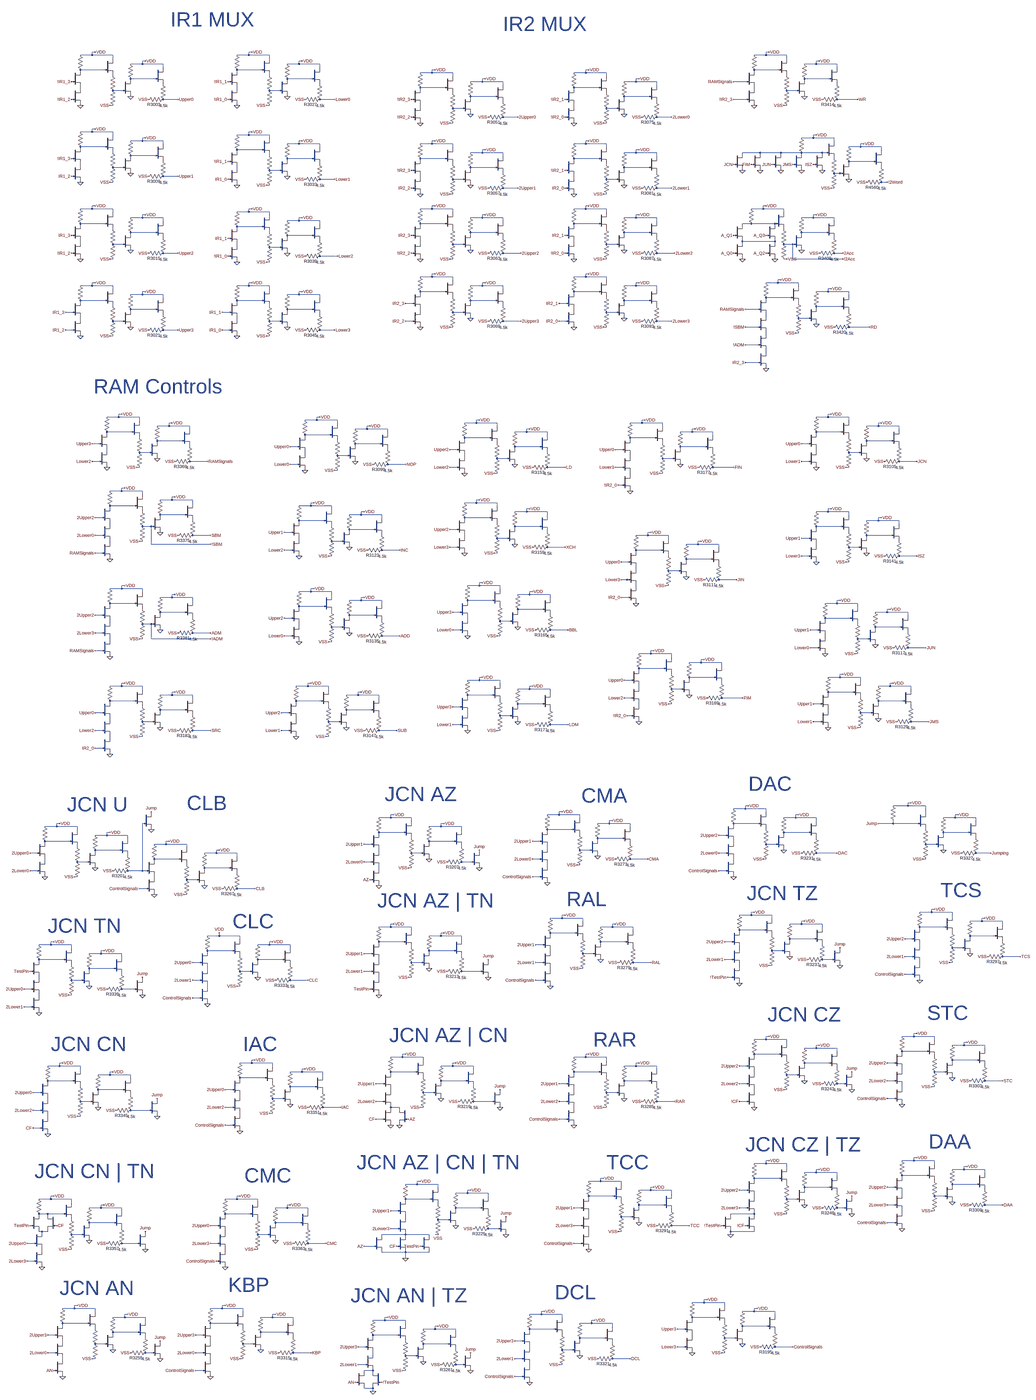
[diagram p0: schematic instruction_register_mux.asc, whole sheet]
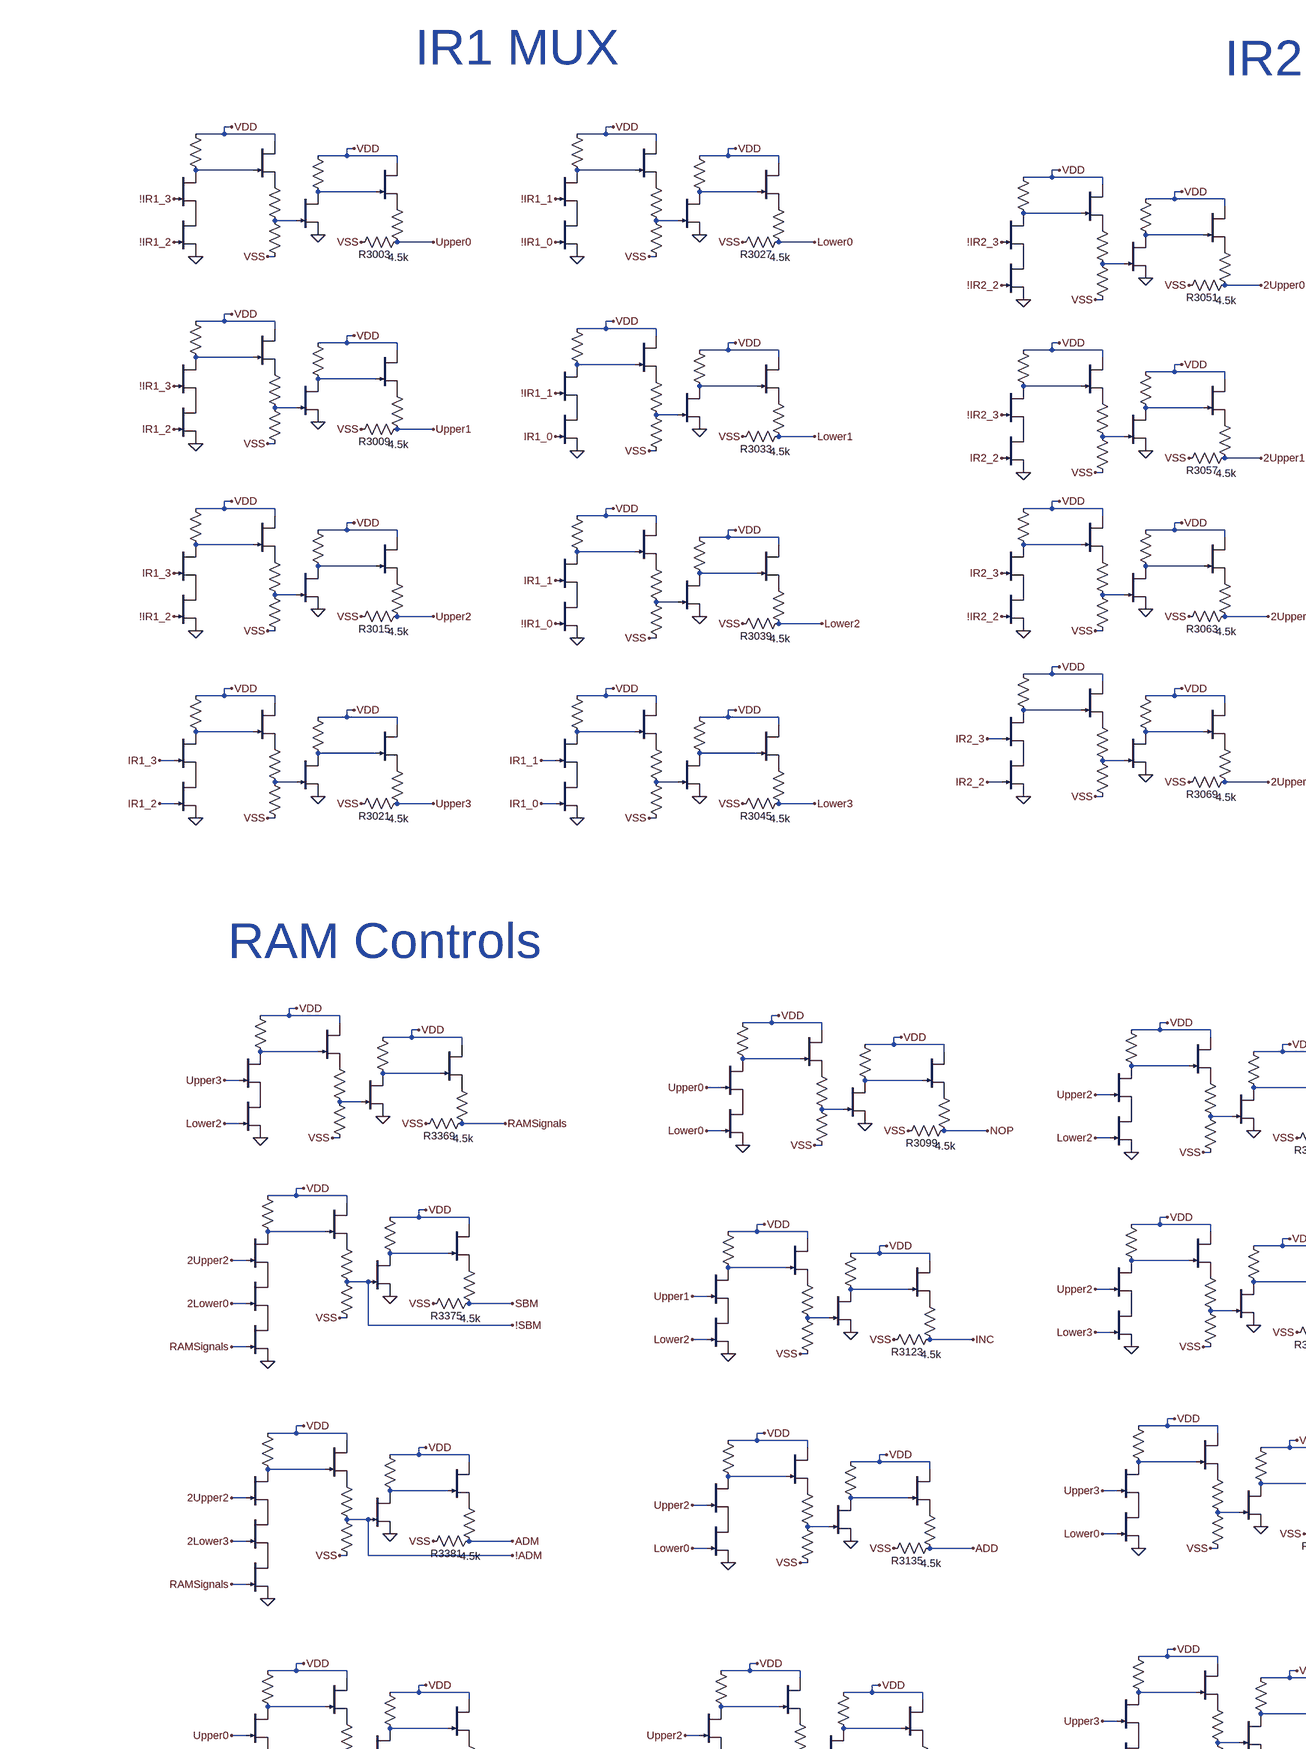
[diagram p1: schematic instruction_register_mux.asc, part, row 1 of 2, column 1 of 2]
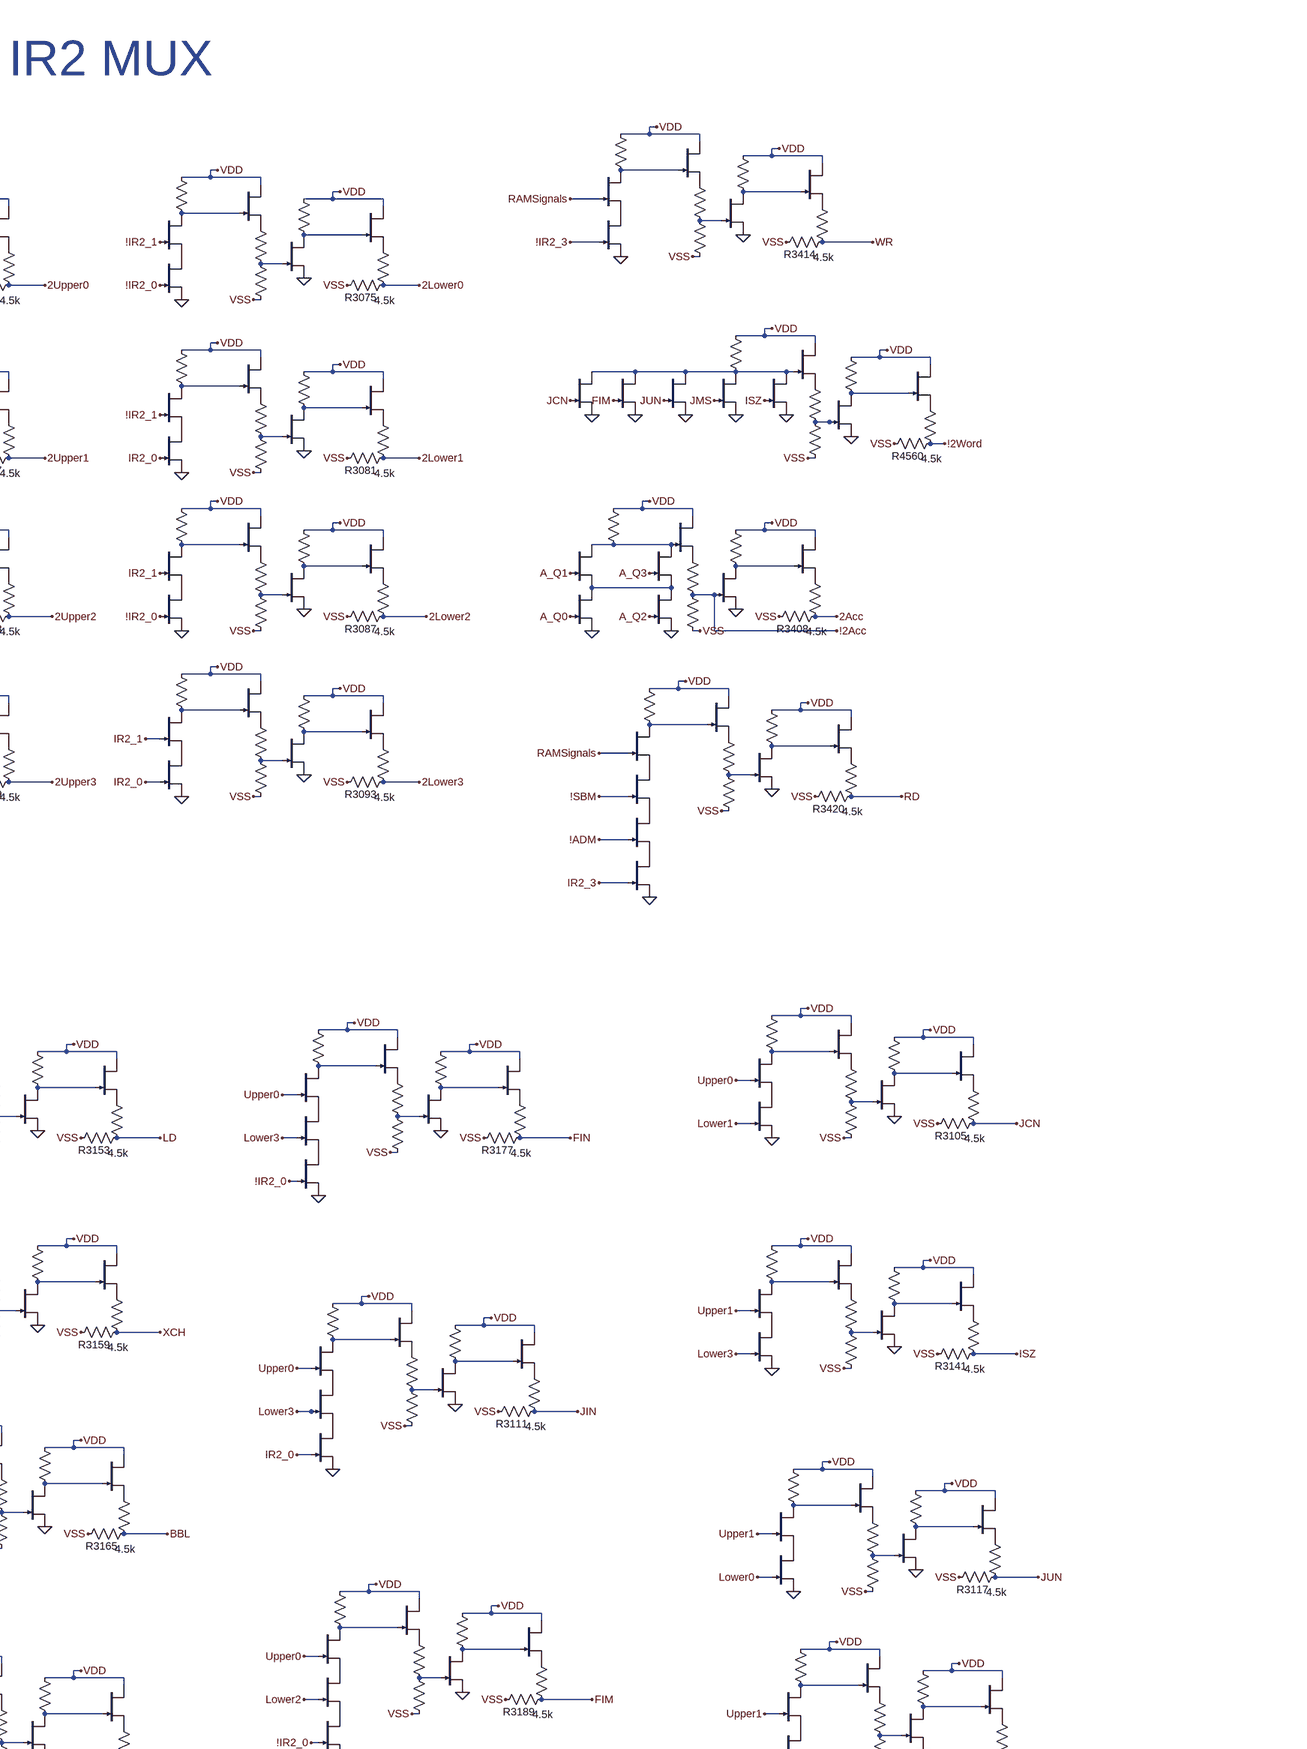
[diagram p2: schematic instruction_register_mux.asc, part, row 1 of 2, column 2 of 2]
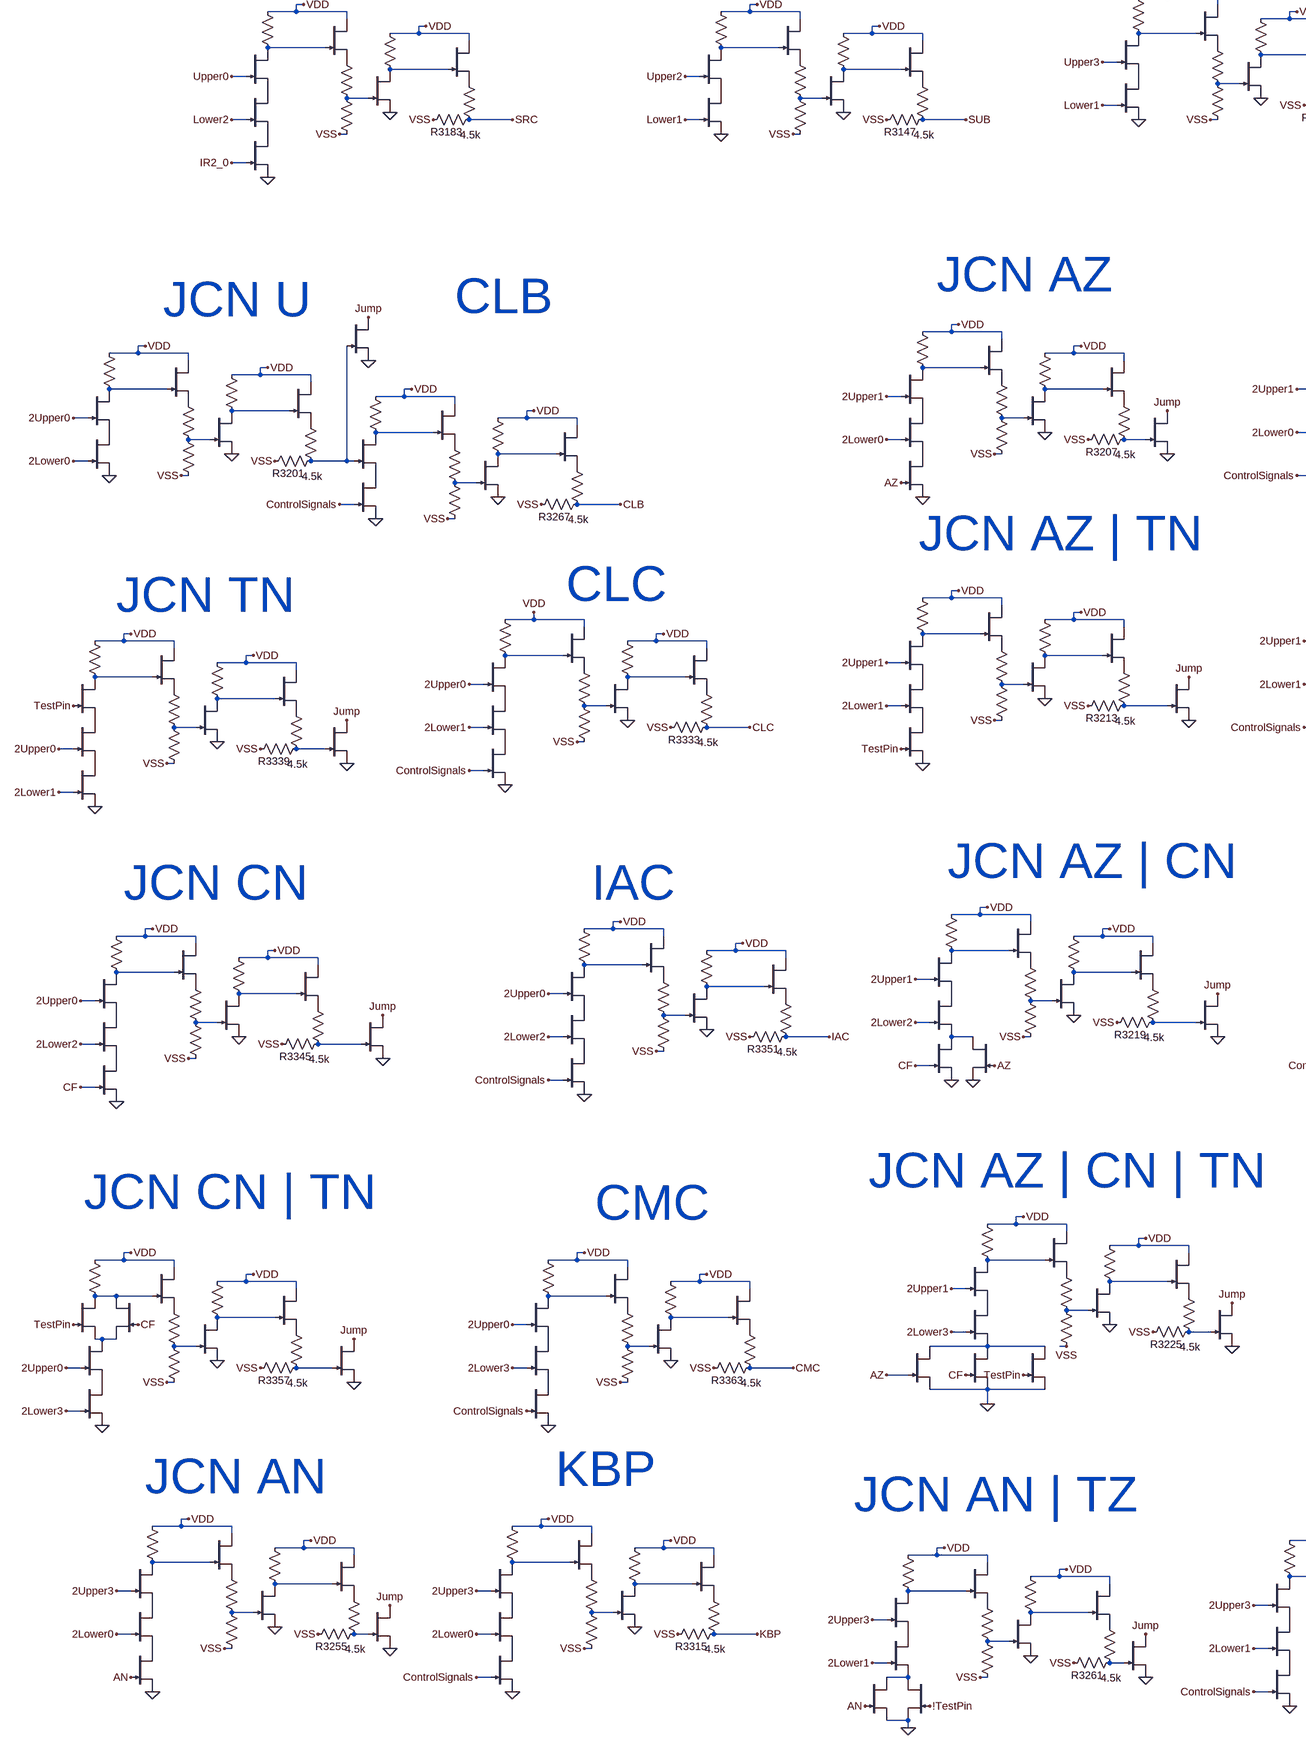
[diagram p3: schematic instruction_register_mux.asc, part, row 2 of 2, column 1 of 2]
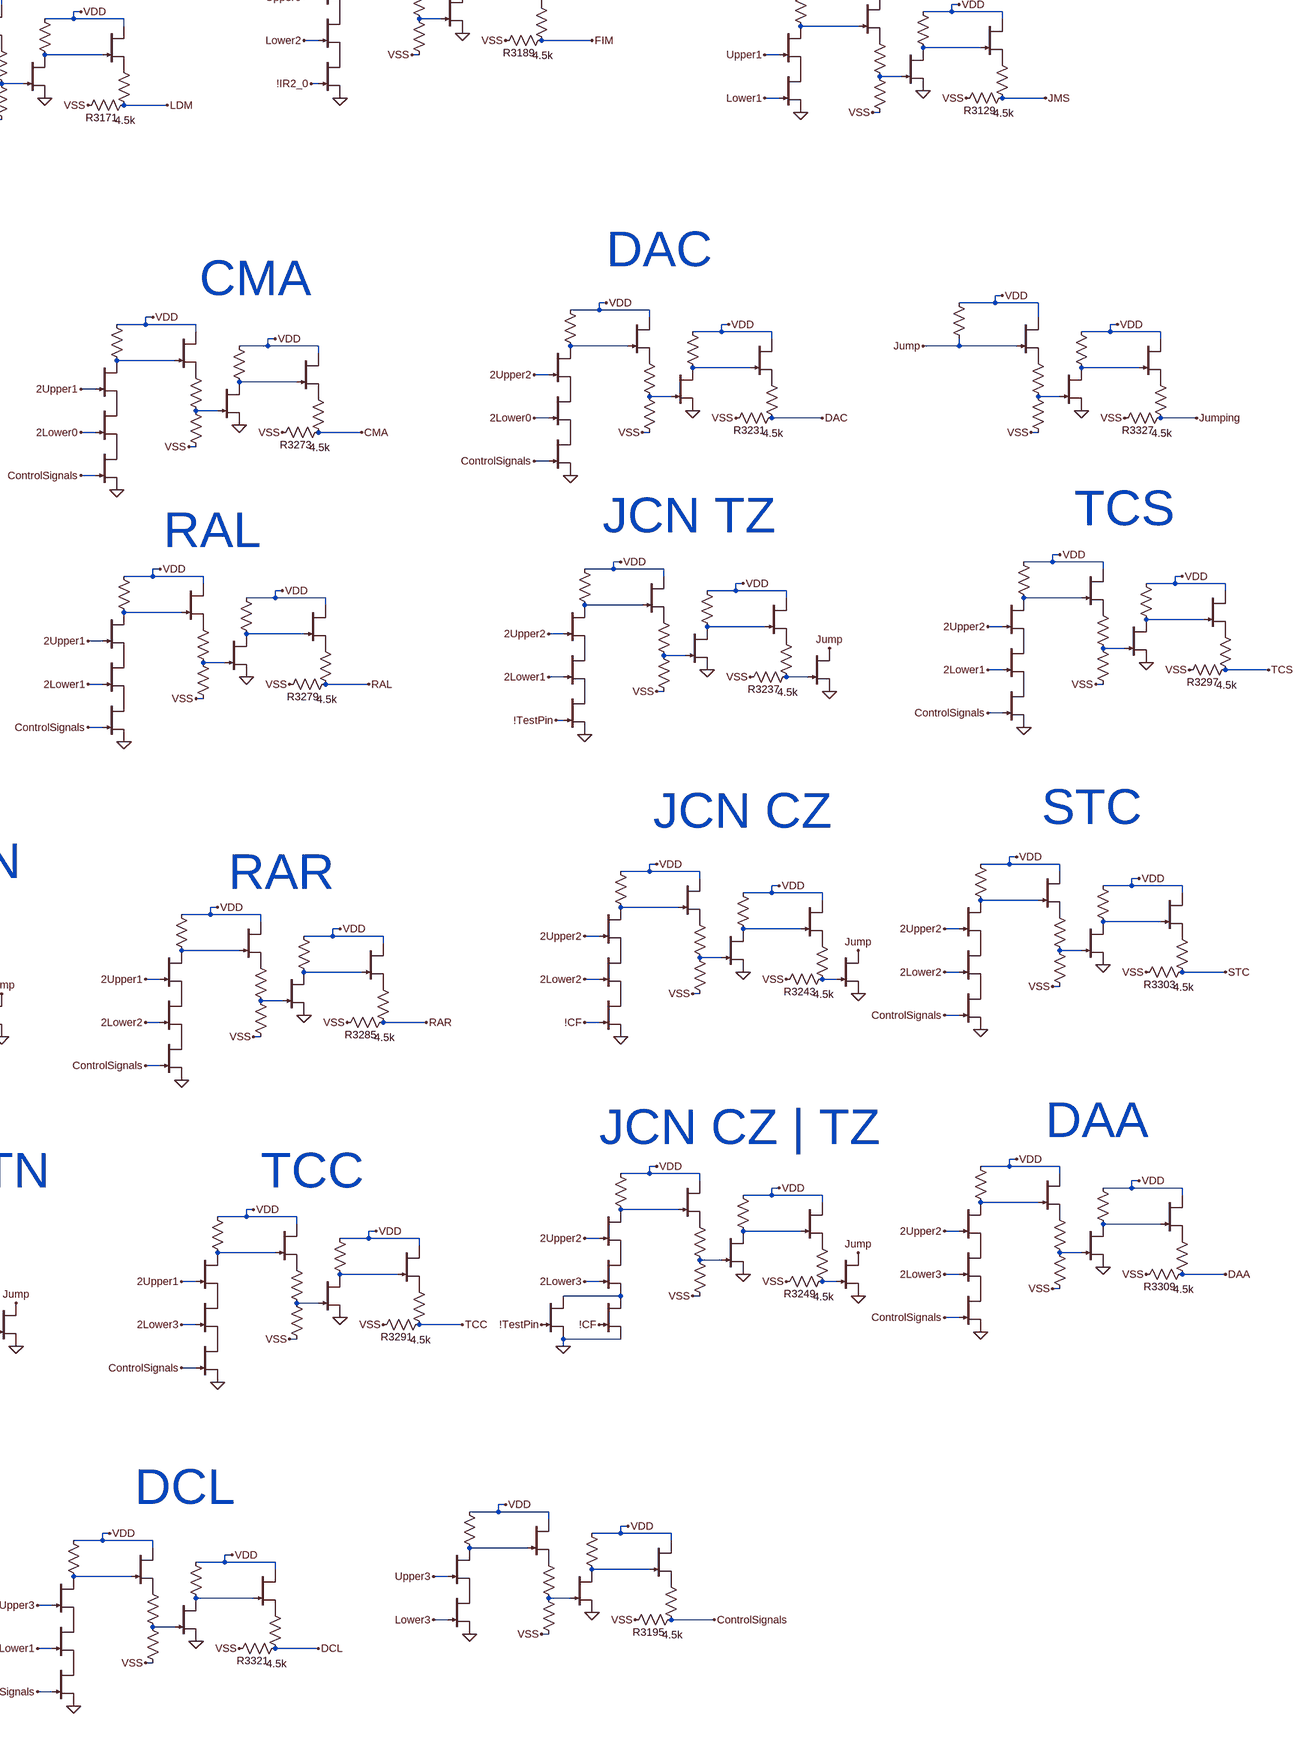
[diagram p4: schematic instruction_register_mux.asc, part, row 2 of 2, column 2 of 2]
* instruction_register_mux.asc
J_A1920 N001 !IR1_3 P001 DR
R2998 VDD N001 100k
J_F734 VDD N001 P002 DR
R2999 P002 N009 1k
R3000 N009 VSS 4.8k
J_B906 P001 !IR1_2 0 DR
J_A1921 N004 N009 0 DR
R3001 VDD N004 50k
J_F735 VDD N004 P003 DR
R3002 P003 Upper0 1k
R3003 Upper0 VSS 4.5k
J_A1922 N016 !IR1_3 P004 DR
R3004 VDD N016 100k
J_F736 VDD N016 P005 DR
R3005 P005 N024 1k
R3006 N024 VSS 4.8k
J_B907 P004 IR1_2 0 DR
J_A1923 N019 N024 0 DR
R3007 VDD N019 50k
J_F737 VDD N019 P006 DR
R3008 P006 Upper1 1k
R3009 Upper1 VSS 4.5k
J_A1924 N031 IR1_3 P007 DR
R3010 VDD N031 100k
J_F738 VDD N031 P008 DR
R3011 P008 N042 1k
R3012 N042 VSS 4.8k
J_B908 P007 !IR1_2 0 DR
J_A1925 N036 N042 0 DR
R3013 VDD N036 50k
J_F739 VDD N036 P009 DR
R3014 P009 Upper2 1k
R3015 Upper2 VSS 4.5k
J_A1926 N049 IR1_3 P010 DR
R3016 VDD N049 100k
J_F740 VDD N049 P011 DR
R3017 P011 N059 1k
R3018 N059 VSS 4.8k
J_B909 P010 IR1_2 0 DR
J_A1927 N054 N059 0 DR
R3019 VDD N054 50k
J_F741 VDD N054 P012 DR
R3020 P012 Upper3 1k
R3021 Upper3 VSS 4.5k
J_A1928 N002 !IR1_1 P013 DR
R3022 VDD N002 100k
J_F742 VDD N002 P014 DR
R3023 P014 N010 1k
R3024 N010 VSS 4.8k
J_B910 P013 !IR1_0 0 DR
J_A1929 N005 N010 0 DR
R3025 VDD N005 50k
J_F743 VDD N005 P015 DR
R3026 P015 Lower0 1k
R3027 Lower0 VSS 4.5k
J_A1930 N017 !IR1_1 P016 DR
R3028 VDD N017 100k
J_F744 VDD N017 P017 DR
R3029 P017 N027 1k
R3030 N027 VSS 4.8k
J_B911 P016 IR1_0 0 DR
J_A1931 N020 N027 0 DR
R3031 VDD N020 50k
J_F745 VDD N020 P018 DR
R3032 P018 Lower1 1k
R3033 Lower1 VSS 4.5k
J_A1932 N035 IR1_1 P019 DR
R3034 VDD N035 100k
J_F746 VDD N035 P020 DR
R3035 P020 N045 1k
R3036 N045 VSS 4.8k
J_B912 P019 !IR1_0 0 DR
J_A1933 N040 N045 0 DR
R3037 VDD N040 50k
J_F747 VDD N040 P021 DR
R3038 P021 Lower2 1k
R3039 Lower2 VSS 4.5k
J_A1934 N050 IR1_1 P022 DR
R3040 VDD N050 100k
J_F748 VDD N050 P023 DR
R3041 P023 N060 1k
R3042 N060 VSS 4.8k
J_B913 P022 IR1_0 0 DR
J_A1935 N055 N060 0 DR
R3043 VDD N055 50k
J_F749 VDD N055 P024 DR
R3044 P024 Lower3 1k
R3045 Lower3 VSS 4.5k
J_A1936 N007 !IR2_3 P025 DR
R3046 VDD N007 100k
J_F750 VDD N007 P026 DR
R3047 P026 N014 1k
R3048 N014 VSS 4.8k
J_B914 P025 !IR2_2 0 DR
J_A1937 N012 N014 0 DR
R3049 VDD N012 50k
J_F751 VDD N012 P027 DR
R3050 P027 2Upper0 1k
R3051 2Upper0 VSS 4.5k
J_A1938 N021 !IR2_3 P028 DR
R3052 VDD N021 100k
J_F752 VDD N021 P029 DR
R3053 P029 N029 1k
R3054 N029 VSS 4.8k
J_B915 P028 IR2_2 0 DR
J_A1939 N025 N029 0 DR
R3055 VDD N025 50k
J_F753 VDD N025 P030 DR
R3056 P030 2Upper1 1k
R3057 2Upper1 VSS 4.5k
J_A1940 N032 IR2_3 P031 DR
R3058 VDD N032 100k
J_F754 VDD N032 P032 DR
R3059 P032 N043 1k
R3060 N043 VSS 4.8k
J_B916 P031 !IR2_2 0 DR
J_A1941 N037 N043 0 DR
R3061 VDD N037 50k
J_F755 VDD N037 P033 DR
R3062 P033 2Upper2 1k
R3063 2Upper2 VSS 4.5k
J_A1942 N046 IR2_3 P034 DR
R3064 VDD N046 100k
J_F756 VDD N046 P035 DR
R3065 P035 N056 1k
R3066 N056 VSS 4.8k
J_B917 P034 IR2_2 0 DR
J_A1943 N051 N056 0 DR
R3067 VDD N051 50k
J_F757 VDD N051 P036 DR
R3068 P036 2Upper3 1k
R3069 2Upper3 VSS 4.5k
J_A1944 N008 !IR2_1 P037 DR
R3070 VDD N008 100k
J_F758 VDD N008 P038 DR
R3071 P038 N015 1k
R3072 N015 VSS 4.8k
J_B918 P037 !IR2_0 0 DR
J_A1945 N013 N015 0 DR
R3073 VDD N013 50k
J_F759 VDD N013 P039 DR
R3074 P039 2Lower0 1k
R3075 2Lower0 VSS 4.5k
J_A1946 N022 !IR2_1 P040 DR
R3076 VDD N022 100k
J_F760 VDD N022 P041 DR
R3077 P041 N030 1k
R3078 N030 VSS 4.8k
J_B919 P040 IR2_0 0 DR
J_A1947 N026 N030 0 DR
R3079 VDD N026 50k
J_F761 VDD N026 P042 DR
R3080 P042 2Lower1 1k
R3081 2Lower1 VSS 4.5k
J_A1948 N033 IR2_1 P043 DR
R3082 VDD N033 100k
J_F762 VDD N033 P044 DR
R3083 P044 N044 1k
R3084 N044 VSS 4.8k
J_B920 P043 !IR2_0 0 DR
J_A1949 N038 N044 0 DR
R3085 VDD N038 50k
J_F763 VDD N038 P045 DR
R3086 P045 2Lower2 1k
R3087 2Lower2 VSS 4.5k
J_A1950 N047 IR2_1 P046 DR
R3088 VDD N047 100k
J_F764 VDD N047 P047 DR
R3089 P047 N057 1k
R3090 N057 VSS 4.8k
J_B921 P046 IR2_0 0 DR
J_A1951 N052 N057 0 DR
R3091 VDD N052 50k
J_F765 VDD N052 P048 DR
R3092 P048 2Lower3 1k
R3093 2Lower3 VSS 4.5k
J_A1952 N063 Upper0 P049 DR
R3094 VDD N063 100k
J_F766 VDD N063 P050 DR
R3095 P050 N073 1k
R3096 N073 VSS 4.8k
J_B922 P049 Lower0 0 DR
J_A1953 N068 N073 0 DR
R3097 VDD N068 50k
J_F767 VDD N068 P051 DR
R3098 P051 NOP 1k
R3099 NOP VSS 4.5k
J_A1954 N062 Upper0 P052 DR
R3100 VDD N062 100k
J_F768 VDD N062 P053 DR
R3101 P053 N072 1k
R3102 N072 VSS 4.8k
J_B923 P052 Lower1 0 DR
J_A1955 N067 N072 0 DR
R3103 VDD N067 50k
J_F769 VDD N067 P054 DR
R3104 P054 JCN 1k
R3105 JCN VSS 4.5k
J_A1956 N087 Upper0 P055 DR
R3106 VDD N087 100k
J_F770 VDD N087 P056 DR
R3107 P056 N089 1k
R3108 N089 VSS 4.8k
J_B924 P055 Lower3 P057 DR
J_A1957 N088 N089 0 DR
R3109 VDD N088 50k
J_F771 VDD N088 P058 DR
R3110 P058 JIN 1k
R3111 JIN VSS 4.5k
J_A1958 N096 Upper1 P059 DR
R3112 VDD N096 100k
J_F772 VDD N096 P060 DR
R3113 P060 N100 1k
R3114 N100 VSS 4.8k
J_B925 P059 Lower0 0 DR
J_A1959 N099 N100 0 DR
R3115 VDD N099 50k
J_F773 VDD N099 P061 DR
R3116 P061 JUN 1k
R3117 JUN VSS 4.5k
J_A1960 N079 Upper1 P062 DR
R3118 VDD N079 100k
J_F774 VDD N079 P063 DR
R3119 P063 N085 1k
R3120 N085 VSS 4.8k
J_B926 P062 Lower2 0 DR
J_A1961 N082 N085 0 DR
R3121 VDD N082 50k
J_F775 VDD N082 P064 DR
R3122 P064 INC 1k
R3123 INC VSS 4.5k
J_A1962 N104 Upper1 P065 DR
R3124 VDD N104 100k
J_F776 VDD N104 P066 DR
R3125 P066 N112 1k
R3126 N112 VSS 4.8k
J_B927 P065 Lower1 0 DR
J_A1963 N108 N112 0 DR
R3127 VDD N108 50k
J_F777 VDD N108 P067 DR
R3128 P067 JMS 1k
R3129 JMS VSS 4.5k
J_A1964 N092 Upper2 P068 DR
R3130 VDD N092 100k
J_F778 VDD N092 P069 DR
R3131 P069 N098 1k
R3132 N098 VSS 4.8k
J_B928 P068 Lower0 0 DR
J_A1965 N095 N098 0 DR
R3133 VDD N095 50k
J_F779 VDD N095 P070 DR
R3134 P070 ADD 1k
R3135 ADD VSS 4.5k
J_A1966 N081 Upper1 P071 DR
R3136 VDD N081 100k
J_F780 VDD N081 P072 DR
R3137 P072 N086 1k
R3138 N086 VSS 4.8k
J_B929 P071 Lower3 0 DR
J_A1967 N083 N086 0 DR
R3139 VDD N083 50k
J_F781 VDD N083 P073 DR
R3140 P073 ISZ 1k
R3141 ISZ VSS 4.5k
J_A1968 N107 Upper2 P074 DR
R3142 VDD N107 100k
J_F782 VDD N107 P075 DR
R3143 P075 N115 1k
R3144 N115 VSS 4.8k
J_B930 P074 Lower1 0 DR
J_A1969 N111 N115 0 DR
R3145 VDD N111 50k
J_F783 VDD N111 P076 DR
R3146 P076 SUB 1k
R3147 SUB VSS 4.5k
J_A1970 N064 Upper2 P077 DR
R3148 VDD N064 100k
J_F784 VDD N064 P078 DR
R3149 P078 N074 1k
R3150 N074 VSS 4.8k
J_B931 P077 Lower2 0 DR
J_A1971 N069 N074 0 DR
R3151 VDD N069 50k
J_F785 VDD N069 P079 DR
R3152 P079 LD 1k
R3153 LD VSS 4.5k
J_A1972 N078 Upper2 P080 DR
R3154 VDD N078 100k
J_F786 VDD N078 P081 DR
R3155 P081 N084 1k
R3156 N084 VSS 4.8k
J_B932 P080 Lower3 0 DR
J_A1973 N080 N084 0 DR
R3157 VDD N080 50k
J_F787 VDD N080 P082 DR
R3158 P082 XCH 1k
R3159 XCH VSS 4.5k
J_A1974 N090 Upper3 P083 DR
R3160 VDD N090 100k
J_F788 VDD N090 P084 DR
R3161 P084 N097 1k
R3162 N097 VSS 4.8k
J_B933 P083 Lower0 0 DR
J_A1975 N093 N097 0 DR
R3163 VDD N093 50k
J_F789 VDD N093 P085 DR
R3164 P085 BBL 1k
R3165 BBL VSS 4.5k
J_A1976 N105 Upper3 P086 DR
R3166 VDD N105 100k
J_F790 VDD N105 P087 DR
R3167 P087 N113 1k
R3168 N113 VSS 4.8k
J_B934 P086 Lower1 0 DR
J_A1977 N109 N113 0 DR
R3169 VDD N109 50k
J_F791 VDD N109 P088 DR
R3170 P088 LDM 1k
R3171 LDM VSS 4.5k
J_B935 P057 IR2_0 0 DR
J_A1978 N065 Upper0 P089 DR
R3172 VDD N065 100k
J_F792 VDD N065 P090 DR
R3173 P090 N075 1k
R3174 N075 VSS 4.8k
J_B936 P089 Lower3 P091 DR
J_A1979 N070 N075 0 DR
R3175 VDD N070 50k
J_F793 VDD N070 P092 DR
R3176 P092 FIN 1k
R3177 FIN VSS 4.5k
J_B937 P091 !IR2_0 0 DR
J_A1980 N106 Upper0 P093 DR
R3178 VDD N106 100k
J_F794 VDD N106 P094 DR
R3179 P094 N114 1k
R3180 N114 VSS 4.8k
J_B938 P093 Lower2 P095 DR
J_A1981 N110 N114 0 DR
R3181 VDD N110 50k
J_F795 VDD N110 P096 DR
R3182 P096 SRC 1k
R3183 SRC VSS 4.5k
J_B939 P095 IR2_0 0 DR
J_A1982 N101 Upper0 P097 DR
R3184 VDD N101 100k
J_F796 VDD N101 P098 DR
R3185 P098 N103 1k
R3186 N103 VSS 4.8k
J_B940 P097 Lower2 P099 DR
J_A1983 N102 N103 0 DR
R3187 VDD N102 50k
J_F797 VDD N102 P100 DR
R3188 P100 FIM 1k
R3189 FIM VSS 4.5k
J_B941 P099 !IR2_0 0 DR
J_A1984 N202 Upper3 P101 DR
R3190 VDD N202 100k
J_F798 VDD N202 P102 DR
R3191 P102 N211 1k
R3192 N211 VSS 4.8k
J_B942 P101 Lower3 0 DR
J_A1985 N205 N211 0 DR
R3193 VDD N205 50k
J_F799 VDD N205 P103 DR
R3194 P103 ControlSignals 1k
R3195 ControlSignals VSS 4.5k
J_A1986 N122 2Upper0 P104 DR
R3196 VDD N122 100k
J_F800 VDD N122 P105 DR
R3197 P105 N130 1k
R3198 N130 VSS 4.8k
J_B943 P104 2Lower0 0 DR
J_A1987 N126 N130 0 DR
R3199 VDD N126 50k
J_F801 VDD N126 P106 DR
R3200 P106 N133 1k
R3201 N133 VSS 4.5k
J_A1988 N118 2Upper1 P107 DR
R3202 VDD N118 100k
J_F802 VDD N118 P108 DR
R3203 P108 N128 1k
R3204 N128 VSS 4.8k
J_B944 P107 2Lower0 P109 DR
J_A1989 N123 N128 0 DR
R3205 VDD N123 50k
J_F803 VDD N123 P110 DR
R3206 P110 N131 1k
R3207 N131 VSS 4.5k
J_A1990 N140 2Upper1 P111 DR
R3208 VDD N140 100k
J_F804 VDD N140 P112 DR
R3209 P112 N150 1k
R3210 N150 VSS 4.8k
J_B945 P111 2Lower1 P113 DR
J_A1991 N144 N150 0 DR
R3211 VDD N144 50k
J_F805 VDD N144 P114 DR
R3212 P114 N153 1k
R3213 N153 VSS 4.5k
J_A1992 N160 2Upper1 P115 DR
R3214 VDD N160 100k
J_F806 VDD N160 P116 DR
R3215 P116 N171 1k
R3216 N171 VSS 4.8k
J_B946 P115 2Lower2 N176 DR
J_A1993 N166 N171 0 DR
R3217 VDD N166 50k
J_F807 VDD N166 P117 DR
R3218 P117 N175 1k
R3219 N175 VSS 4.5k
J_A1994 N184 2Upper1 P118 DR
R3220 VDD N184 100k
J_F808 VDD N184 P119 DR
R3221 P119 N193 1k
R3222 N193 VSS 4.8k
J_B947 P118 2Lower3 N200 DR
J_A1995 N187 N193 0 DR
R3223 VDD N187 50k
J_F809 VDD N187 P120 DR
R3224 P120 N196 1k
R3225 N196 VSS 4.5k
J_A1996 N116 2Upper2 P121 DR
R3226 VDD N116 100k
J_F810 VDD N116 P122 DR
R3227 P122 N124 1k
R3228 N124 VSS 4.8k
J_B948 P121 2Lower0 P123 DR
J_A1997 N119 N124 0 DR
R3229 VDD N119 50k
J_F811 VDD N119 P124 DR
R3230 P124 DAC 1k
R3231 DAC VSS 4.5k
J_A1998 N136 2Upper2 P125 DR
R3232 VDD N136 100k
J_F812 VDD N136 P126 DR
R3233 P126 N145 1k
R3234 N145 VSS 4.8k
J_B949 P125 2Lower1 P127 DR
J_A1999 N139 N145 0 DR
R3235 VDD N139 50k
J_F813 VDD N139 P128 DR
R3236 P128 N149 1k
R3237 N149 VSS 4.5k
J_A2000 N157 2Upper2 P129 DR
R3238 VDD N157 100k
J_F814 VDD N157 P130 DR
R3239 P130 N163 1k
R3240 N163 VSS 4.8k
J_B950 P129 2Lower2 P131 DR
J_A2001 N159 N163 0 DR
R3241 VDD N159 50k
J_F815 VDD N159 P132 DR
R3242 P132 N168 1k
R3243 N168 VSS 4.5k
J_A2002 N179 2Upper2 P133 DR
R3244 VDD N179 100k
J_F816 VDD N179 P134 DR
R3245 P134 N185 1k
R3246 N185 VSS 4.8k
J_B951 P133 2Lower3 N191 DR
J_A2003 N181 N185 0 DR
R3247 VDD N181 50k
J_F817 VDD N181 P135 DR
R3248 P135 N188 1k
R3249 N188 VSS 4.5k
J_A2004 N203 2Upper3 P136 DR
R3250 VDD N203 100k
J_F818 VDD N203 P137 DR
R3251 P137 N212 1k
R3252 N212 VSS 4.8k
J_B952 P136 2Lower0 P138 DR
J_A2005 N207 N212 0 DR
R3253 VDD N207 50k
J_F819 VDD N207 P139 DR
R3254 P139 N216 1k
R3255 N216 VSS 4.5k
J_A2006 N209 2Upper3 P140 DR
R3256 VDD N209 100k
J_F820 VDD N209 P141 DR
R3257 P141 N217 1k
R3258 N217 VSS 4.8k
J_B953 P140 2Lower1 N219 DR
J_A2007 N214 N217 0 DR
R3259 VDD N214 50k
J_F821 VDD N214 P142 DR
R3260 P142 N218 1k
R3261 N218 VSS 4.5k
J_A2008 N129 N133 P143 DR
R3262 VDD N129 100k
J_F822 VDD N129 P144 DR
R3263 P144 N134 1k
R3264 N134 VSS 4.8k
J_B954 P143 ControlSignals 0 DR
J_A2009 N132 N134 0 DR
R3265 VDD N132 50k
J_F823 VDD N132 P145 DR
R3266 P145 CLB 1k
R3267 CLB VSS 4.5k
J_A2010 N117 2Upper1 P146 DR
R3268 VDD N117 100k
J_F824 VDD N117 P147 DR
R3269 P147 N127 1k
R3270 N127 VSS 4.8k
J_B955 P148 ControlSignals 0 DR
J_A2011 N121 N127 0 DR
R3271 VDD N121 50k
J_F825 VDD N121 P149 DR
R3272 P149 CMA 1k
R3273 CMA VSS 4.5k
J_A2012 N137 2Upper1 P150 DR
R3274 VDD N137 100k
J_F826 VDD N137 P151 DR
R3275 P151 N146 1k
R3276 N146 VSS 4.8k
J_B956 P152 ControlSignals 0 DR
J_A2013 N141 N146 0 DR
R3277 VDD N141 50k
J_F827 VDD N141 P153 DR
R3278 P153 RAL 1k
R3279 RAL VSS 4.5k
J_A2014 N161 2Upper1 P154 DR
R3280 VDD N161 100k
J_F828 VDD N161 P155 DR
R3281 P155 N172 1k
R3282 N172 VSS 4.8k
J_B957 P156 ControlSignals 0 DR
J_A2015 N167 N172 0 DR
R3283 VDD N167 50k
J_F829 VDD N167 P157 DR
R3284 P157 RAR 1k
R3285 RAR VSS 4.5k
J_A2016 N182 2Upper1 P158 DR
R3286 VDD N182 100k
J_F830 VDD N182 P159 DR
R3287 P159 N192 1k
R3288 N192 VSS 4.8k
J_B958 P160 ControlSignals 0 DR
J_A2017 N186 N192 0 DR
R3289 VDD N186 50k
J_F831 VDD N186 P161 DR
R3290 P161 TCC 1k
R3291 TCC VSS 4.5k
J_B959 P123 ControlSignals 0 DR
J_A2018 N135 2Upper2 P162 DR
R3292 VDD N135 100k
J_F832 VDD N135 P163 DR
R3293 P163 N142 1k
R3294 N142 VSS 4.8k
J_B960 P164 ControlSignals 0 DR
J_A2019 N138 N142 0 DR
R3295 VDD N138 50k
J_F833 VDD N138 P165 DR
R3296 P165 TCS 1k
R3297 TCS VSS 4.5k
J_A2020 N156 2Upper2 P166 DR
R3298 VDD N156 100k
J_F834 VDD N156 P167 DR
R3299 P167 N162 1k
R3300 N162 VSS 4.8k
J_B961 P168 ControlSignals 0 DR
J_A2021 N158 N162 0 DR
R3301 VDD N158 50k
J_F835 VDD N158 P169 DR
R3302 P169 STC 1k
R3303 STC VSS 4.5k
J_A2022 N178 2Upper2 P170 DR
R3304 VDD N178 100k
J_F836 VDD N178 P171 DR
R3305 P171 N183 1k
R3306 N183 VSS 4.8k
J_B962 P172 ControlSignals 0 DR
J_A2023 N180 N183 0 DR
R3307 VDD N180 50k
J_F837 VDD N180 P173 DR
R3308 P173 DAA 1k
R3309 DAA VSS 4.5k
J_A2024 N204 2Upper3 P174 DR
R3310 VDD N204 100k
J_F838 VDD N204 P175 DR
R3311 P175 N213 1k
R3312 N213 VSS 4.8k
J_B963 P176 ControlSignals 0 DR
J_A2025 N208 N213 0 DR
R3313 VDD N208 50k
J_F839 VDD N208 P177 DR
R3314 P177 KBP 1k
R3315 KBP VSS 4.5k
J_A2026 N206 2Upper3 P178 DR
R3316 VDD N206 100k
J_F840 VDD N206 P179 DR
R3317 P179 N215 1k
R3318 N215 VSS 4.8k
J_B964 P180 ControlSignals 0 DR
J_A2027 N210 N215 0 DR
R3319 VDD N210 50k
J_F841 VDD N210 P181 DR
R3320 P181 DCL 1k
R3321 DCL VSS 4.5k
J_A2028 N200 AZ 0 DR
J_A2029 N191 !TestPin 0 DR
R3322 VDD Jump 100k
J_F842 VDD Jump P182 DR
R3323 P182 N125 1k
R3324 N125 VSS 4.8k
J_A2030 N120 N125 0 DR
R3325 VDD N120 50k
J_A2031 VDD N120 P183 DR
R3326 P183 Jumping 1k
R3327 Jumping VSS 4.5k
J_A2032 Jump N133 0 DR
J_A2033 Jump N131 0 DR
J_A2034 Jump N153 0 DR
J_A2035 Jump N196 0 DR
J_A2036 Jump N149 0 DR
J_A2037 Jump N168 0 DR
J_A2038 Jump N188 0 DR
J_A2039 Jump N175 0 DR
J_A2040 N200 CF 0 DR
J_A2041 N200 TestPin 0 DR
J_A2042 N191 !CF 0 DR
J_A2043 N219 AN 0 DR
J_A2044 Jump N218 0 DR
J_A2045 N219 !TestPin 0 DR
J_A2046 N143 2Upper0 P184 DR
R3328 VDD N143 100k
J_F843 VDD N143 P185 DR
R3329 P185 N152 1k
R3330 N152 VSS 4.8k
J_B965 P184 2Lower1 P186 DR
J_A2047 N148 N152 0 DR
R3331 VDD N148 50k
J_F844 VDD N148 P187 DR
R3332 P187 CLC 1k
R3333 CLC VSS 4.5k
J_A2048 N147 TestPin P188 DR
R3334 VDD N147 100k
J_F845 VDD N147 P189 DR
R3335 P189 N154 1k
R3336 N154 VSS 4.8k
J_B966 P188 2Upper0 P190 DR
J_A2049 N151 N154 0 DR
R3337 VDD N151 50k
J_F846 VDD N151 P191 DR
R3338 P191 N155 1k
R3339 N155 VSS 4.5k
J_A2050 Jump N155 0 DR
J_B967 P190 2Lower1 0 DR
J_B968 P186 ControlSignals 0 DR
J_A2051 N165 2Upper0 P192 DR
R3340 VDD N165 100k
J_F847 VDD N165 P193 DR
R3341 P193 N174 1k
R3342 N174 VSS 4.8k
J_B969 P192 2Lower2 P194 DR
J_A2052 N170 N174 0 DR
R3343 VDD N170 50k
J_F848 VDD N170 P195 DR
R3344 P195 N177 1k
R3345 N177 VSS 4.5k
J_A2053 N164 2Upper0 P196 DR
R3346 VDD N164 100k
J_F849 VDD N164 P197 DR
R3347 P197 N173 1k
R3348 N173 VSS 4.8k
J_B970 P198 ControlSignals 0 DR
J_A2054 N169 N173 0 DR
R3349 VDD N169 50k
J_F850 VDD N169 P199 DR
R3350 P199 IAC 1k
R3351 IAC VSS 4.5k
J_A2055 Jump N177 0 DR
J_B971 P194 CF 0 DR
J_A2056 P196 2Lower2 P198 DR
J_A2057 N197 2Upper0 P200 DR
R3352 VDD N189 100k
J_F851 VDD N189 P201 DR
R3353 P201 N198 1k
R3354 N198 VSS 4.8k
J_B972 P200 2Lower3 0 DR
J_A2058 N194 N198 0 DR
R3355 VDD N194 50k
J_F852 VDD N194 P202 DR
R3356 P202 N201 1k
R3357 N201 VSS 4.5k
J_A2059 N190 2Upper0 P203 DR
R3358 VDD N190 100k
J_F853 VDD N190 P204 DR
R3359 P204 N199 1k
R3360 N199 VSS 4.8k
J_B973 P203 2Lower3 P205 DR
J_A2060 N195 N199 0 DR
R3361 VDD N195 50k
J_F854 VDD N195 P206 DR
R3362 P206 CMC 1k
R3363 CMC VSS 4.5k
J_A2061 Jump N201 0 DR
J_A2062 N189 TestPin N197 DR
J_B974 N189 CF N197 DR
J_B975 P205 ControlSignals 0 DR
J_A2063 P109 AZ 0 DR
J_B976 P146 2Lower0 P148 DR
J_A2064 P113 TestPin 0 DR
J_A2065 P150 2Lower1 P152 DR
J_B977 N176 CF 0 DR
J_B978 N176 AZ 0 DR
J_A2066 P154 2Lower2 P156 DR
J_A2067 P158 2Lower3 P160 DR
J_B979 P127 !TestPin 0 DR
J_A2068 P162 2Lower1 P164 DR
J_B980 P131 !CF 0 DR
J_A2069 P166 2Lower2 P168 DR
J_A2070 P170 2Lower3 P172 DR
J_B981 P138 AN 0 DR
J_A2071 Jump N216 0 DR
J_A2072 P174 2Lower0 P176 DR
J_A2073 P178 2Lower1 P180 DR
J_A2074 N061 Upper3 P207 DR
R3364 VDD N061 100k
J_F855 VDD N061 P208 DR
R3365 P208 N071 1k
R3366 N071 VSS 4.8k
J_B982 P207 Lower2 0 DR
J_A2075 N066 N071 0 DR
R3367 VDD N066 50k
J_F856 VDD N066 P209 DR
R3368 P209 RAMSignals 1k
R3369 RAMSignals VSS 4.5k
J_A2076 N076 2Upper2 P210 DR
R3370 VDD N076 100k
J_F857 VDD N076 P211 DR
R3371 P211 !SBM 1k
R3372 !SBM VSS 4.8k
J_B983 P210 2Lower0 P212 DR
J_A2077 N077 !SBM 0 DR
R3373 VDD N077 50k
J_F858 VDD N077 P213 DR
R3374 P213 SBM 1k
R3375 SBM VSS 4.5k
J_A2078 N091 2Upper2 P214 DR
R3376 VDD N091 100k
J_F859 VDD N091 P215 DR
R3377 P215 !ADM 1k
R3378 !ADM VSS 4.8k
J_B984 P214 2Lower3 P216 DR
J_A2079 N094 !ADM 0 DR
R3379 VDD N094 50k
J_F860 VDD N094 P217 DR
R3380 P217 ADM 1k
R3381 ADM VSS 4.5k
J_B985 P212 RAMSignals 0 DR
J_B986 P216 RAMSignals 0 DR
J_A2080 N018 ISZ 0 DR
R3382 VDD N018 100k
J_F861 VDD N018 P218 DR
R3383 P218 N028 1k
R3384 N028 VSS 4.8k
J_A2081 N018 JMS 0 DR
J_A2082 N018 JUN 0 DR
J_A2083 N018 FIM 0 DR
J_A2084 N018 JCN 0 DR
R3403 VDD N034 100k
J_F868 VDD N034 P219 DR
R3404 P219 !2Acc 1k
R3405 !2Acc VSS 4.8k
J_A2094 N039 !2Acc 0 DR
R3406 VDD N039 50k
J_F869 VDD N039 P220 DR
R3407 P220 2Acc 1k
R3408 2Acc VSS 4.5k
J_A2095 N034 A_Q1 N041 DR
J_A2096 N041 A_Q0 0 DR
J_A2097 N034 A_Q3 N041 DR
J_A2098 N041 A_Q2 0 DR
J_A2099 N003 RAMSignals P221 DR
R3409 VDD N003 100k
J_F870 VDD N003 P222 DR
R3410 P222 N011 1k
R3411 N011 VSS 4.8k
J_B989 P221 !IR2_3 0 DR
J_A2100 N006 N011 0 DR
R3412 VDD N006 50k
J_F871 VDD N006 P223 DR
R3413 P223 WR 1k
R3414 WR VSS 4.5k
J_A2101 N048 RAMSignals P224 DR
R3415 VDD N048 100k
J_F872 VDD N048 P225 DR
R3416 P225 N058 1k
R3417 N058 VSS 4.8k
J_B990 P226 IR2_3 0 DR
J_A2102 N053 N058 0 DR
R3418 VDD N053 50k
J_F873 VDD N053 P227 DR
R3419 P227 RD 1k
R3420 RD VSS 4.5k
J_B991 P228 !ADM P226 DR
J_B992 P224 !SBM P228 DR
J_A2647 N023 N028 0 DR
R4558 VDD N023 50k
J_F1201 VDD N023 P229 DR
R4559 P229 !2Word 1k
R4560 !2Word VSS 4.5k
.model NJF NJF
.model PJF PJF
.lib standard.jft
* IR1 MUX
* IR2 MUX
* JCN U
* CLB
* JCN AZ
* CMA
* JCN AZ | TN
* RAL
* RAR
* JCN AZ | CN
* JCN AZ | CN | TN
* TCC
* JCN TZ
* TCS
* JCN CZ
* STC
* DAC
* JCN CZ | TZ
* DAA
* JCN AN
* KBP
* JCN AN | TZ
* DCL
* JCN TN
* CLC
* JCN CN
* IAC
* JCN CN | TN
* CMC
* RAM Controls
.backanno
.end